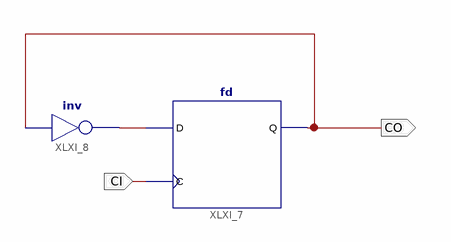
[diagram p0: schematic sheet 1]
// Xilinx ISE schematic div2.sch (spartan6) as structural Verilog: 2 symbols, 2 ports
module div2 (
  input  CI,
  output CO
);

  wire XLXN_7;

  fd XLXI_7 (.C(CI), .D(XLXN_7), .Q(CO));
  not XLXI_8 (XLXN_7, CO);
endmodule
